# Altium schematic sheet MyCTRL_V2_Base_4.SchDoc
size A4; SheetNumber: 4; SheetTotal: 6
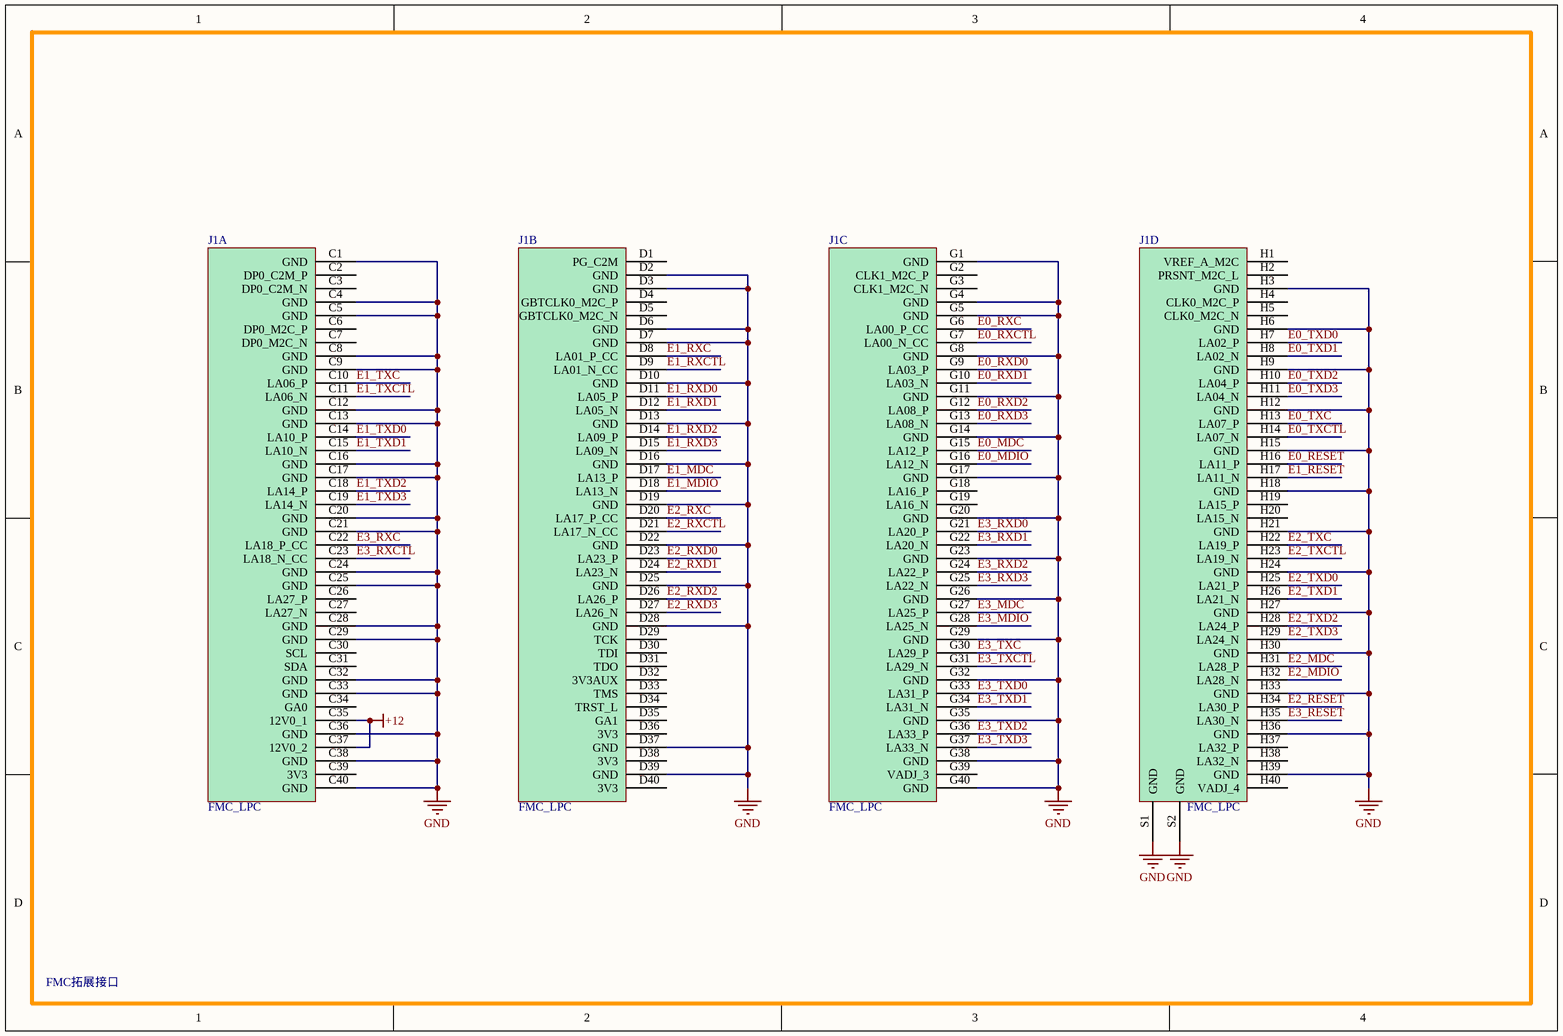
[diagram p0: MyCTRL_V2_Base_4.SchDoc]

## Parts
J1  FMC_LPC  (parts A,B,C,D of 4)

## Nets
+12: J1.C35(12V0_1) J1.C37(12V0_2)
GND: J1.C1(GND) J1.C4(GND) J1.C5(GND) J1.C8(GND) J1.C9(GND) J1.C12(GND) J1.C13(GND) J1.C16(GND) J1.C17(GND) J1.C20(GND) J1.C21(GND) J1.C24(GND) J1.C25(GND) J1.C28(GND) J1.C29(GND) J1.C32(GND) J1.C33(GND) J1.C36(GND) J1.C38(GND) J1.C40(GND) J1.D2(GND) J1.D3(GND) J1.D6(GND) J1.D7(GND) J1.D10(GND) J1.D13(GND) J1.D16(GND) J1.D19(GND) J1.D22(GND) J1.D25(GND) J1.D28(GND) J1.D37(GND) J1.D39(GND) J1.G1(GND) J1.G4(GND) J1.G5(GND) J1.G8(GND) J1.G11(GND) J1.G14(GND) J1.G17(GND) J1.G20(GND) J1.G23(GND) J1.G26(GND) J1.G29(GND) J1.G32(GND) J1.G35(GND) J1.G38(GND) J1.G40(GND) J1.H3(GND) J1.H6(GND) J1.H9(GND) J1.H12(GND) J1.H15(GND) J1.H18(GND) J1.H21(GND) J1.H24(GND) J1.H27(GND) J1.H30(GND) J1.H33(GND) J1.H36(GND) J1.H39(GND) J1.S1(GND) J1.S2(GND)
E0_MDC: J1.G15(LA12_P)
E0_MDIO: J1.G16(LA12_N)
E0_RESET: J1.H16(LA11_P)
E0_RXC: J1.G6(LA00_P_CC)
E0_RXCTL: J1.G7(LA00_N_CC)
E0_RXD0: J1.G9(LA03_P)
E0_RXD1: J1.G10(LA03_N)
E0_RXD2: J1.G12(LA08_P)
E0_RXD3: J1.G13(LA08_N)
E0_TXC: J1.H13(LA07_P)
E0_TXCTL: J1.H14(LA07_N)
E0_TXD0: J1.H7(LA02_P)
E0_TXD1: J1.H8(LA02_N)
E0_TXD2: J1.H10(LA04_P)
E0_TXD3: J1.H11(LA04_N)
E1_MDC: J1.D17(LA13_P)
E1_MDIO: J1.D18(LA13_N)
E1_RESET: J1.H17(LA11_N)
E1_RXC: J1.D8(LA01_P_CC)
E1_RXCTL: J1.D9(LA01_N_CC)
E1_RXD0: J1.D11(LA05_P)
E1_RXD1: J1.D12(LA05_N)
E1_RXD2: J1.D14(LA09_P)
E1_RXD3: J1.D15(LA09_N)
E1_TXC: J1.C10(LA06_P)
E1_TXCTL: J1.C11(LA06_N)
E1_TXD0: J1.C14(LA10_P)
E1_TXD1: J1.C15(LA10_N)
E1_TXD2: J1.C18(LA14_P)
E1_TXD3: J1.C19(LA14_N)
E2_MDC: J1.H31(LA28_P)
E2_MDIO: J1.H32(LA28_N)
E2_RESET: J1.H34(LA30_P)
E2_RXC: J1.D20(LA17_P_CC)
E2_RXCTL: J1.D21(LA17_N_CC)
E2_RXD0: J1.D23(LA23_P)
E2_RXD1: J1.D24(LA23_N)
E2_RXD2: J1.D26(LA26_P)
E2_RXD3: J1.D27(LA26_N)
E2_TXC: J1.H22(LA19_P)
E2_TXCTL: J1.H23(LA19_N)
E2_TXD0: J1.H25(LA21_P)
E2_TXD1: J1.H26(LA21_N)
E2_TXD2: J1.H28(LA24_P)
E2_TXD3: J1.H29(LA24_N)
E3_MDC: J1.G27(LA25_P)
E3_MDIO: J1.G28(LA25_N)
E3_RESET: J1.H35(LA30_N)
E3_RXC: J1.C22(LA18_P_CC)
E3_RXCTL: J1.C23(LA18_N_CC)
E3_RXD0: J1.G21(LA20_P)
E3_RXD1: J1.G22(LA20_N)
E3_RXD2: J1.G24(LA22_P)
E3_RXD3: J1.G25(LA22_N)
E3_TXC: J1.G30(LA29_P)
E3_TXCTL: J1.G31(LA29_N)
E3_TXD0: J1.G33(LA31_P)
E3_TXD1: J1.G34(LA31_N)
E3_TXD2: J1.G36(LA33_P)
E3_TXD3: J1.G37(LA33_N)

Not connected (* = marked no-connect by the designer): J1 C2(DP0_C2M_P) C3(DP0_C2M_N) C6(DP0_M2C_P) C7(DP0_M2C_N) C26(LA27_P) C27(LA27_N) C30(SCL) C31(SDA) C34(GA0) C39(3V3) D1(PG_C2M) D4(GBTCLK0_M2C_P) D5(GBTCLK0_M2C_N) D29(TCK) D30(TDI) D31(TDO) D32(3V3AUX) D33(TMS) D34(TRST_L) D35(GA1) D36(3V3) D38(3V3) D40(3V3) G2(CLK1_M2C_P) G3(CLK1_M2C_N) G18(LA16_P) G19(LA16_N) G39(VADJ_3) H1(VREF_A_M2C) H2(PRSNT_M2C_L) H4(CLK0_M2C_P) H5(CLK0_M2C_N) H19(LA15_P) H20(LA15_N) H37(LA32_P) H38(LA32_N) H40(VADJ_4)

## Notes on the sheet
- FMC拓展接口

## Library data of the parts
J1 = FMC_LPC_F_SMT